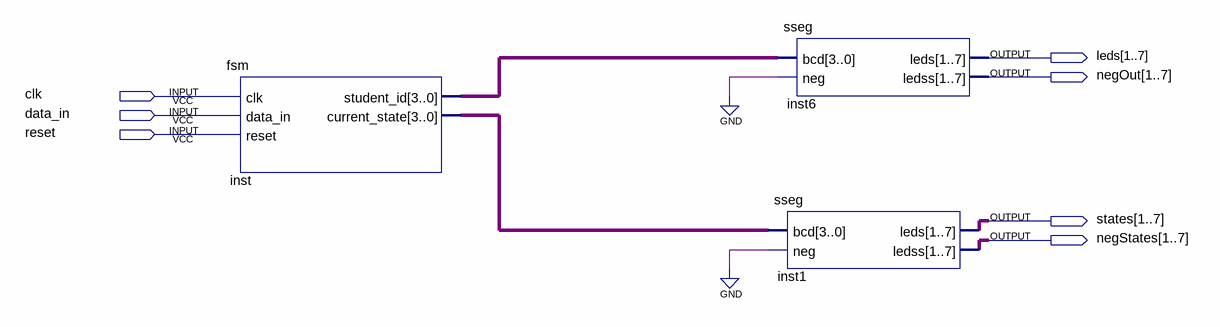
[diagram p0: schematic sheet]
// Quartus schematic Lab5.bdf as structural Verilog: 3 symbols, 7 pins
module Lab5 (
  input  clk,
  input  data_in,
  input  reset,
  output [1:7] leds,
  output [1:7] negOut,
  output [1:7] states,
  output [1:7] negStates
);

  wire [3:0] inst_current_state, inst_student_id;

  fsm inst (
    .clk(clk), .data_in(data_in), .reset(reset), .student_id(inst_student_id),
    .current_state(inst_current_state));
  sseg inst6 (.bcd(inst_student_id), .neg(1'b0), .leds(leds), .ledss(negOut));
  sseg inst1 (.bcd(inst_current_state), .neg(1'b0), .leds(states), .ledss(negStates));
endmodule
